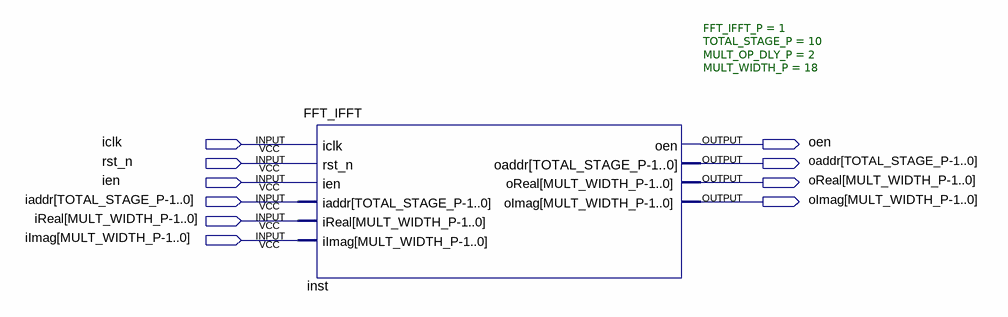
[diagram p0: schematic sheet]
// Quartus schematic FFT_new.bdf as structural Verilog: 1 symbols, 10 pins
module FFT_new (
  input  iclk,
  input  rst_n,
  input  ien,
  input  \iaddr[TOTAL_STAGE_P-1..0] ,
  input  \iReal[MULT_WIDTH_P-1..0] ,
  input  \iImag[MULT_WIDTH_P-1..0] ,
  output oen,
  output \oaddr[TOTAL_STAGE_P-1..0] ,
  output \oReal[MULT_WIDTH_P-1..0] ,
  output \oImag[MULT_WIDTH_P-1..0] 
);

  FFT_IFFT #(.FFT_IFFT_P(1), .TOTAL_STAGE_P(10), .MULT_OP_DLY_P(2), .MULT_WIDTH_P(18)) inst (
    .iclk(iclk), .rst_n(rst_n), .ien(ien), .iaddr({10{\iaddr[TOTAL_STAGE_P-1..0] }}),
    .iReal({18{\iReal[MULT_WIDTH_P-1..0] }}), .iImag({18{\iImag[MULT_WIDTH_P-1..0] }}), .oen(oen),
    .oaddr(\oaddr[TOTAL_STAGE_P-1..0] ), .oReal(\oReal[MULT_WIDTH_P-1..0] ),
    .oImag(\oImag[MULT_WIDTH_P-1..0] ));
endmodule
